# EAGLE design retainer_pnp_opt (EAGLE 7.7.0)
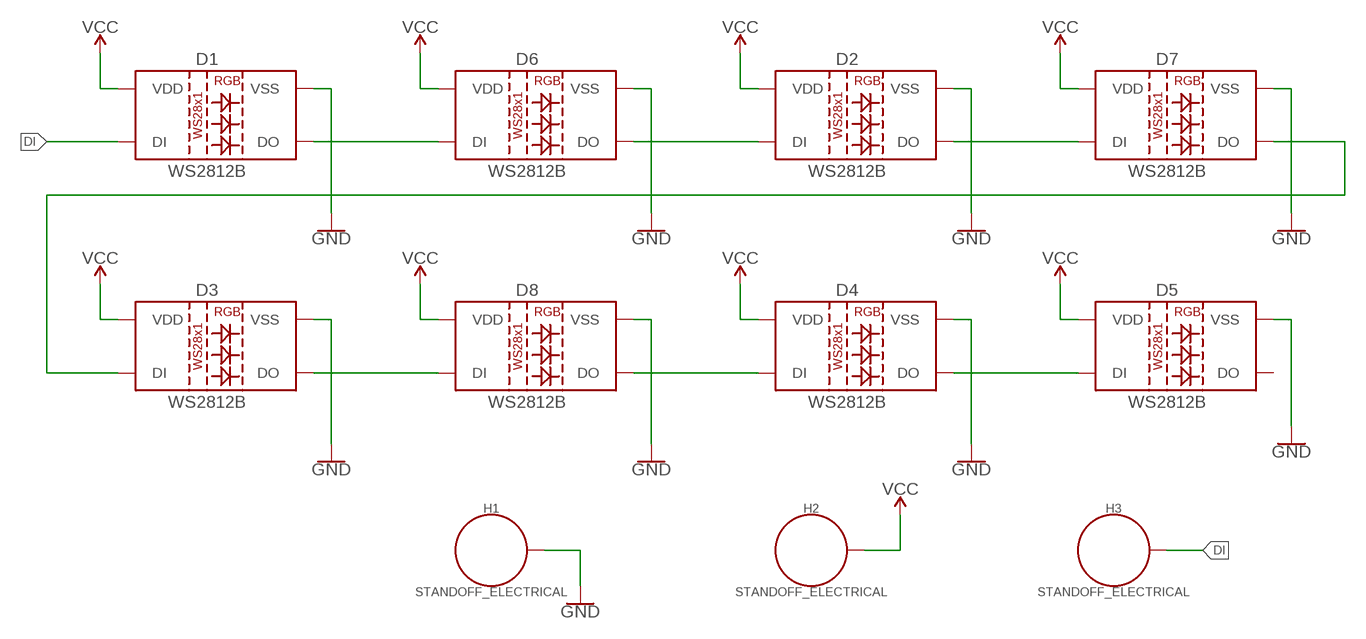
[diagram p0: schematic, sheet 1]

## Parts
D1  WS2812B  [WS2812B]
D2  WS2812B  [WS2812B]
D3  WS2812B  [WS2812B]
D4  WS2812B  [WS2812B]
D5  WS2812B  [WS2812B]
D6  WS2812B  [WS2812B]
D7  WS2812B  [WS2812B]
D8  WS2812B  [WS2812B]
H1  STANDOFF_ELECTRICAL  [STANDOFF-ELECTRICAL]
H2  STANDOFF_ELECTRICAL  [STANDOFF-ELECTRICAL]
H3  STANDOFF_ELECTRICAL  [STANDOFF-ELECTRICAL]

## Nets
DI: D1.4(DI) H3.P1
GND: D1.3(VSS) D2.3(VSS) D3.3(VSS) D4.3(VSS) D5.3(VSS) D6.3(VSS) D7.3(VSS) D8.3(VSS) H1.P1
N$3: D1.2(DO) D6.4(DI)
N$4: D2.4(DI) D6.2(DO)
N$5: D2.2(DO) D7.4(DI)
N$6: D3.4(DI) D7.2(DO)
N$7: D3.2(DO) D8.4(DI)
N$8: D4.4(DI) D8.2(DO)
N$9: D4.2(DO) D5.4(DI)
VCC: D1.1(VDD) D2.1(VDD) D3.1(VDD) D4.1(VDD) D5.1(VDD) D6.1(VDD) D7.1(VDD) D8.1(VDD) H2.P1
Unconnected: D5.2(DO)

## Library data of the parts
D1-D8 = SparkFun-LED:WS2812B: WS2812B SMD addressable RGB LED 5x5mm SMD LED with built-in controller IC. Color: Red/Green/Blue mC Rating: RGB: 390, 660, 180 mcd Forward Voltage: RGB: 2.0, 3.0, 3.0 V Packages:WS2812B SparkFun Products: Blynk Board - ESP8266 <https://www.sparkfun.com/products/13794>; PROD_ID: DIO-12503
H1-H3 = SparkFun-Hardware:STANDOFF_ELECTRICAL: Stand Off Drill holes with an electrical connection. For example, use these to ground your board to a chassis. Example SparkFun Products Screw - Phillips Head (1/4", 4-40, 10 pack) <https://www.sparkfun.com/products/10453> (PRT-10453) Screw - Phillips Head (1/2", 4-40, 10 pack) <https://www.sparkfun.com/products/10452> (PRT-10452) Screw - Phillips Head (3/4", 4-40, 10 pack) <https://www.sparkfun.com/products/10451> (PRT-10451) Screw - Phillips Head (1", 4-40, 10 pack) <https://www.sparkfun.com/products/10450> (PRT-10450)

## Board
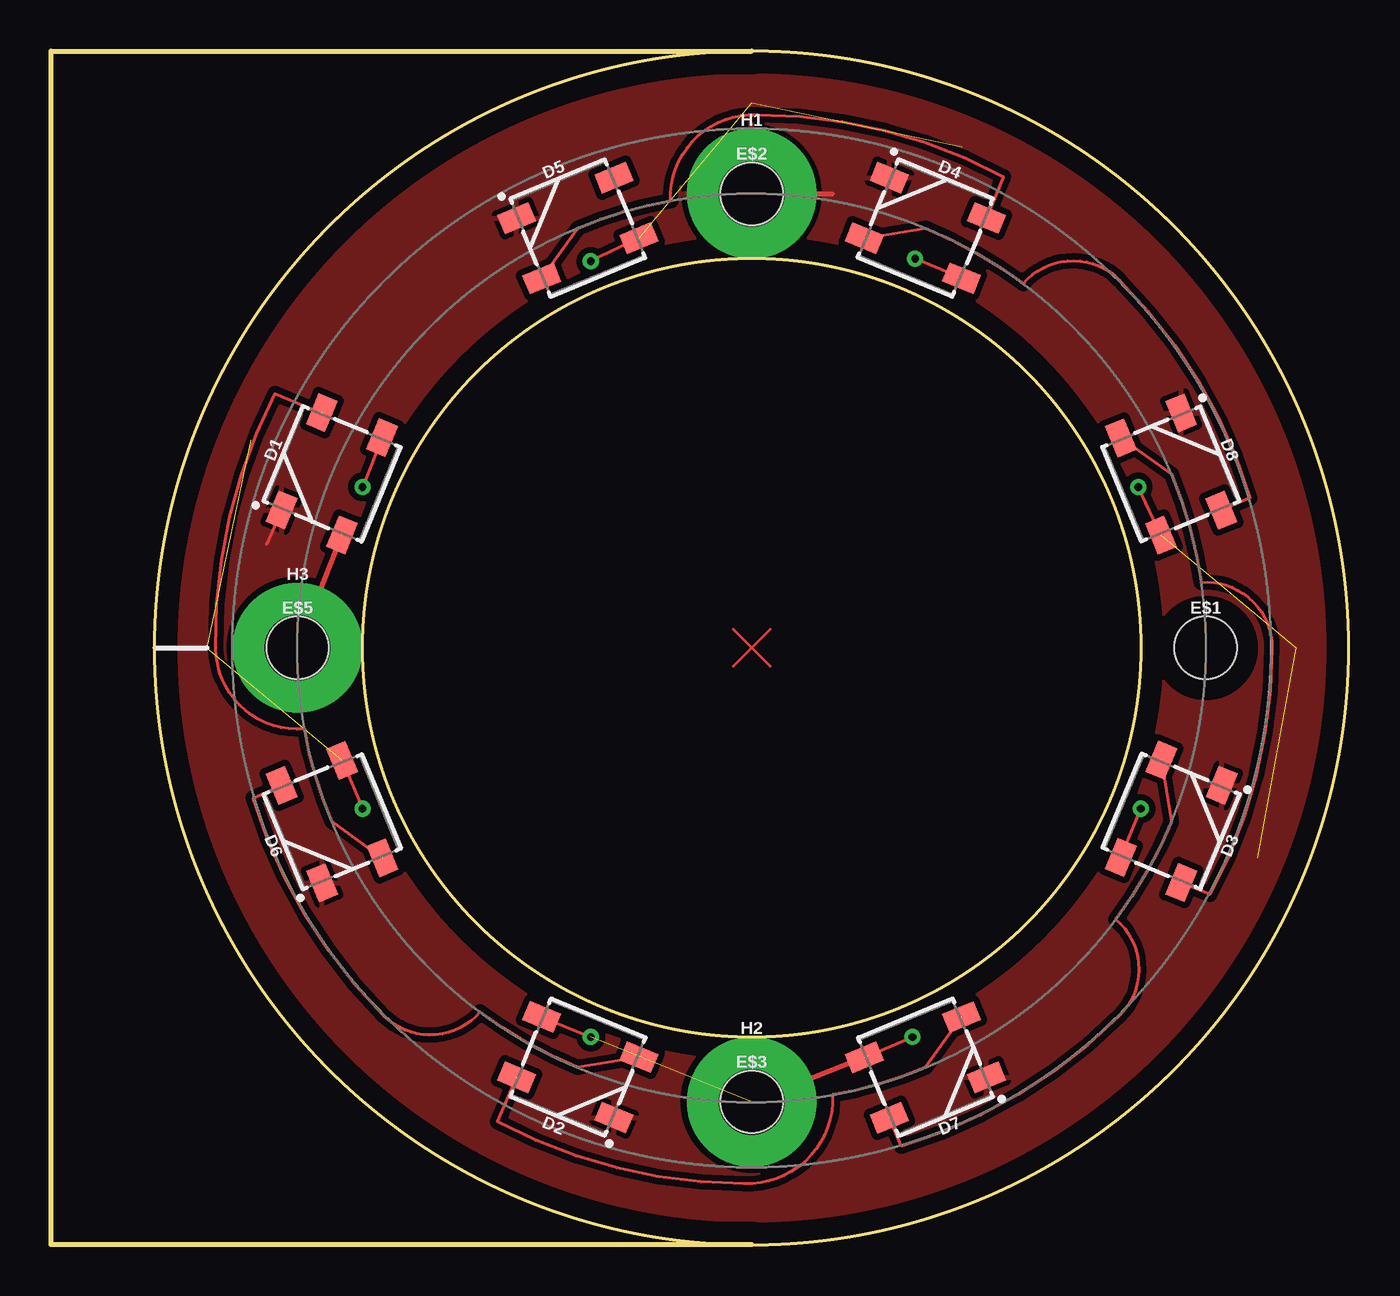
[diagram p1: board, top side]
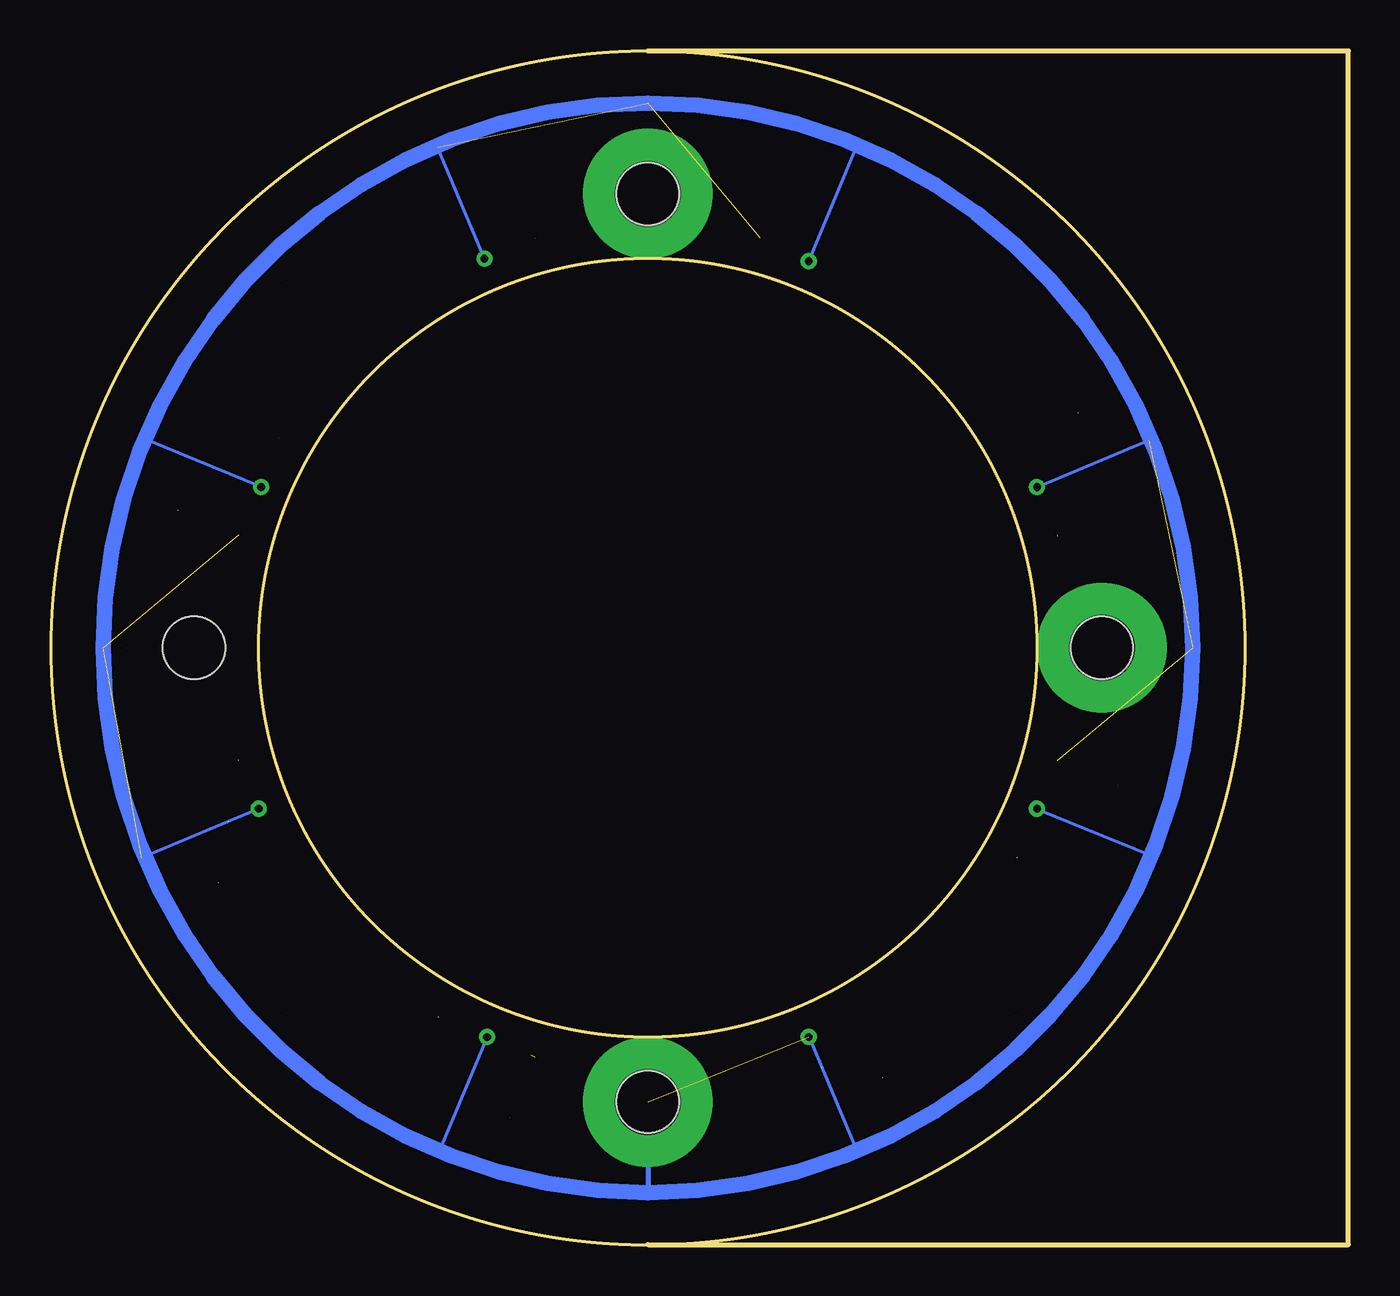
[diagram p2: board, bottom side, seen from below]

Size 63.5 x 58.42 mm. Coordinates in mm from the lower left corner, seen from the top.
Outline: 34.29,0 0,0 0,58.42 34.29,58.42
Outline: circle at 34.29,29.21 radius 19.05
Outline: circle at 34.29,29.21 radius 29.21
Copper layers (1*16): Top 0.035mm / dielectric 1.5mm / Bottom 0.035mm
Design rules "default": minimum track width 10mil, minimum drill 0.6mm, track to track 8mil, track to pad 8mil, pad to pad 8mil, via to via 8mil, smd to smd 8mil, copper to edge 40mil, drill to drill 8mil, minimum pad ring 10mil, minimum via ring 8mil, stop-mask expansion 4mil, vias tented up to drill 0mil, thermal gap 10mil
tRestrict: area 15.2,10.2 to 53.3,48.3

### Footprints (pad centres in the part's own frame; a part is rotated, then mirrored left to right if it is on the bottom)
WS2812B = smd 1.651 x 1: 1 2.577,-1.6; 2 2.577,1.6; 3 -2.577,1.6; 4 -2.577,-1.6
STAND-OFF-TIGHT = hole 3.048: 0,0
STANDOFF-ELECTRICAL = drill 3.2 pad 6.35: P1 0,0

### Placement (x,y rotation side)
D1  13.74,37.73 67.5 top
D2  25.78,8.68 157.5 top
D3  54.83,20.72 247.5 top
D4  42.8,49.76 337.5 top
D5  25.78,49.76 22.5 top
D6  13.75,20.7 112.5 top
D7  42.8,8.67 202.5 top
D8  54.82,37.72 292.5 top
E$1  [STAND-OFF-TIGHT]  56.52,29.21 0 top
E$2  [STAND-OFF-TIGHT]  34.29,51.44 0 top
E$3  [STAND-OFF-TIGHT]  34.29,6.99 0 top
E$5  [STAND-OFF-TIGHT]  12.06,29.21 0 top
H1  34.29,51.44 0 top
H2  34.29,6.99 0 top
H3  12.06,29.21 0 top

### Tracks (layer width: path | path; a pad name or v marks a point on that pad's centre or on a via)
DI  (1 unrouted)
  Top 0.254: H3.P1 14.22,34.67
GND
  Top 0.152: D1.3 10.54,34.29
  Top 0.254: H1.P1 38.23,51.44
  pour Top (isolate 0.305): 34.29,58.42 arc-90 63.5,29.21 arc-90 34.29,0 arc-90 5.08,29.21 arc-90
N$3  (4 unrouted)
  Top 0.152: 16.21,18.93 13.75,20.7 | 13.75,20.71 arc-14 12.41,25.25 12.41,25.24 arc-95 8.06,29.21 arc-28 10.96,41.65 13.25,40.71
N$4  (4 unrouted)
  Top 0.152: 28.77,9.16 25.78,8.67 | 25.78,8.67 arc-14 20.99,11.39 21,11.38 arc-95 16.29,11.21 | 16.28,11.2 arc-28 9.9,21.87 D6.2
N$5  (4 unrouted)
  Top 0.152: 44.57,11.13 42.8,8.67 | 42.79,8.67 arc-14 38.25,7.33 38.26,7.33 arc-95 33.91,2.98 arc-28 21.85,6.01 22.79,8.17
N$6  (4 unrouted)
  Top 0.152: 54.34,23.69 54.83,20.7 | 54.83,20.7 arc-14 52.11,15.91 52.12,15.92 arc-95 52.3,11.21 | 52.3,11.2 arc-28 41.63,4.82 D7.2
N$7  (4 unrouted)
  Top 0.152: 52.37,39.49 54.83,37.72 | 54.83,37.71 arc-14 56.3,32.4 56.29,32.41 arc-95 59.75,29.21 arc-28 56.73,17.15 55.33,17.71
N$8  (4 unrouted)
  Top 0.152: D4.4 42.8,49.75 | 42.8,49.75 arc-14 47.59,47.03 47.58,47.03 arc-95 52.3,47.22 | 52.3,47.22 arc-28 58.68,36.55 57.3,35.96
N$9  (1 unrouted)
  Top 0.152: D5.4 25.79,49.75 arc-14 30.33,51.09 30.32,51.09 arc-95 34.54,55.31 arc-28 46.6,52.28 D4.2
N$10
  Top 0.152: 35.19,28.31 33.39,30.11
N$11
  Top 0.152: 35.19,30.11 33.39,28.31
N$13
  Top 0.152: 35.19,30.11 33.39,28.31
N$17
  Top 0.152: 33.39,28.31 35.19,30.11
N$22
  Top 0.152: 33.39,28.31 35.19,30.11
VCC  (via drill 0.38)  (8 unrouted)
  Top 0.152: D6.1 v15.24,21.34 | D2.1 v26.42,10.16 | D7.1 v42.16,10.16 | D3.1 v53.34,21.34 | D8.1 v53.21,37.08 | D4.1 v42.29,48.26 | D5.1 v26.42,48.13 | D1.1 v15.24,37.08
  Top 0.254: H2.P1 40.01,9.27
  Bottom 0.152: v15.24,21.34 9.65,19.05 | v26.42,10.16 24,4.45 | v42.16,10.16 44.45,4.7 | v53.34,21.34 59.05,18.92 | v53.21,37.08 58.8,39.37 | v42.29,48.26 44.58,53.72 | v26.42,48.13 24.13,53.59 | v15.24,37.08 9.78,39.37
  Bottom 0.254: H2.P1 34.29,2.54
  Bottom 0.762: 34.29,55.88 arc-90 60.96,29.21 arc-90 34.29,2.54 arc-90 7.62,29.21 arc-90 34.29,55.88